# EAGLE schematic HWTestRig (EAGLE 7.4.0)
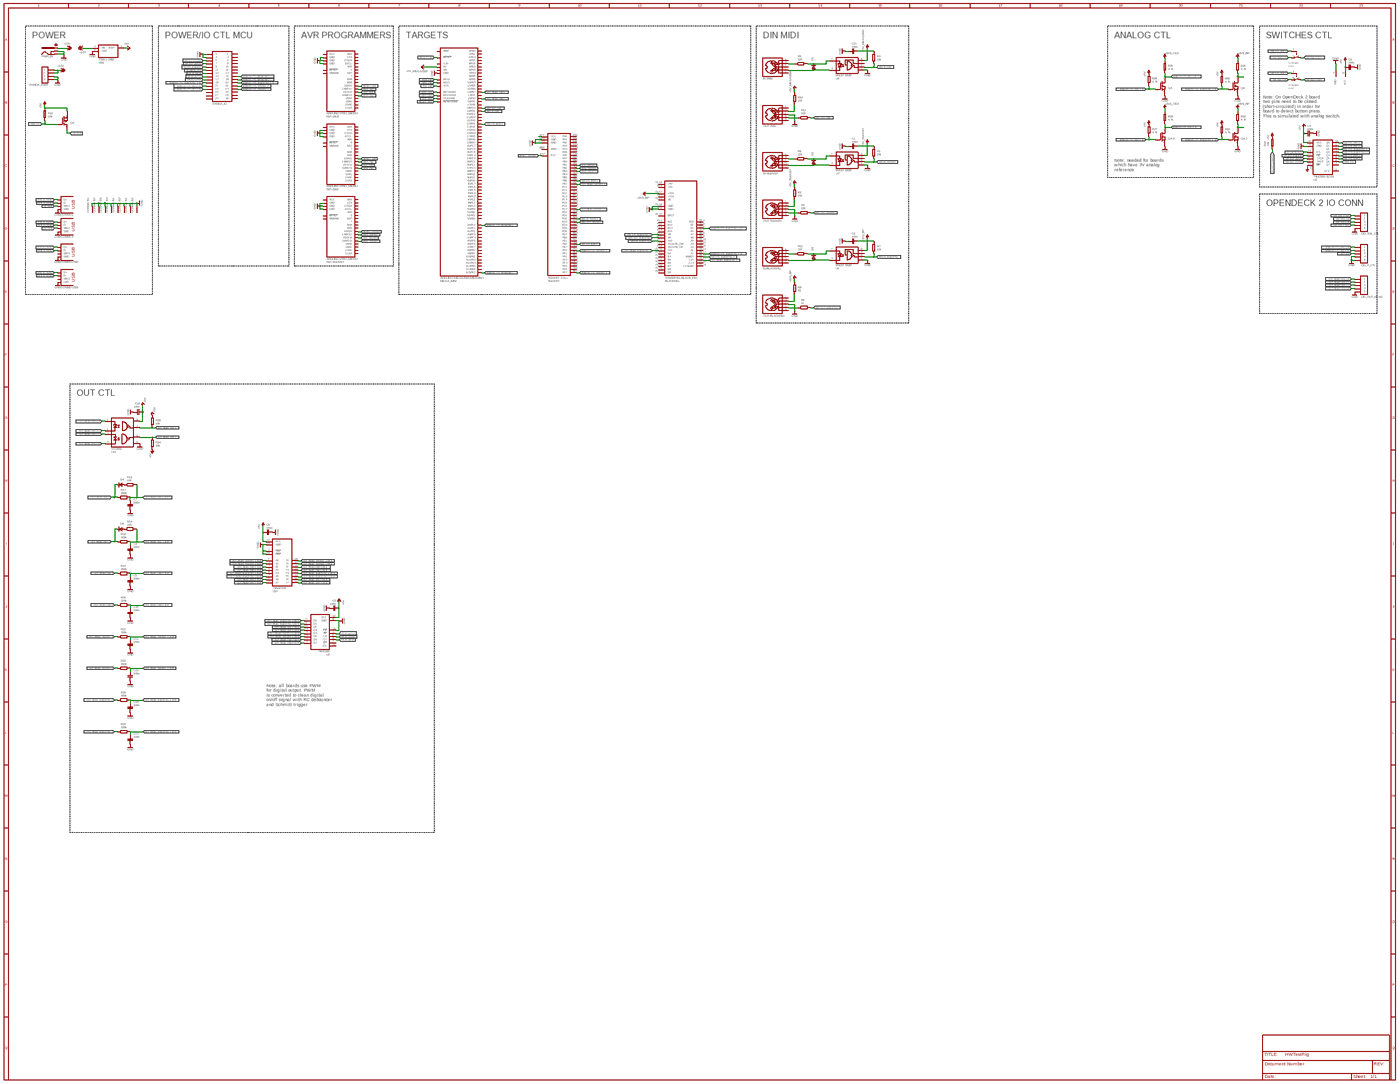
[diagram p0: schematic, sheet 1, overview]
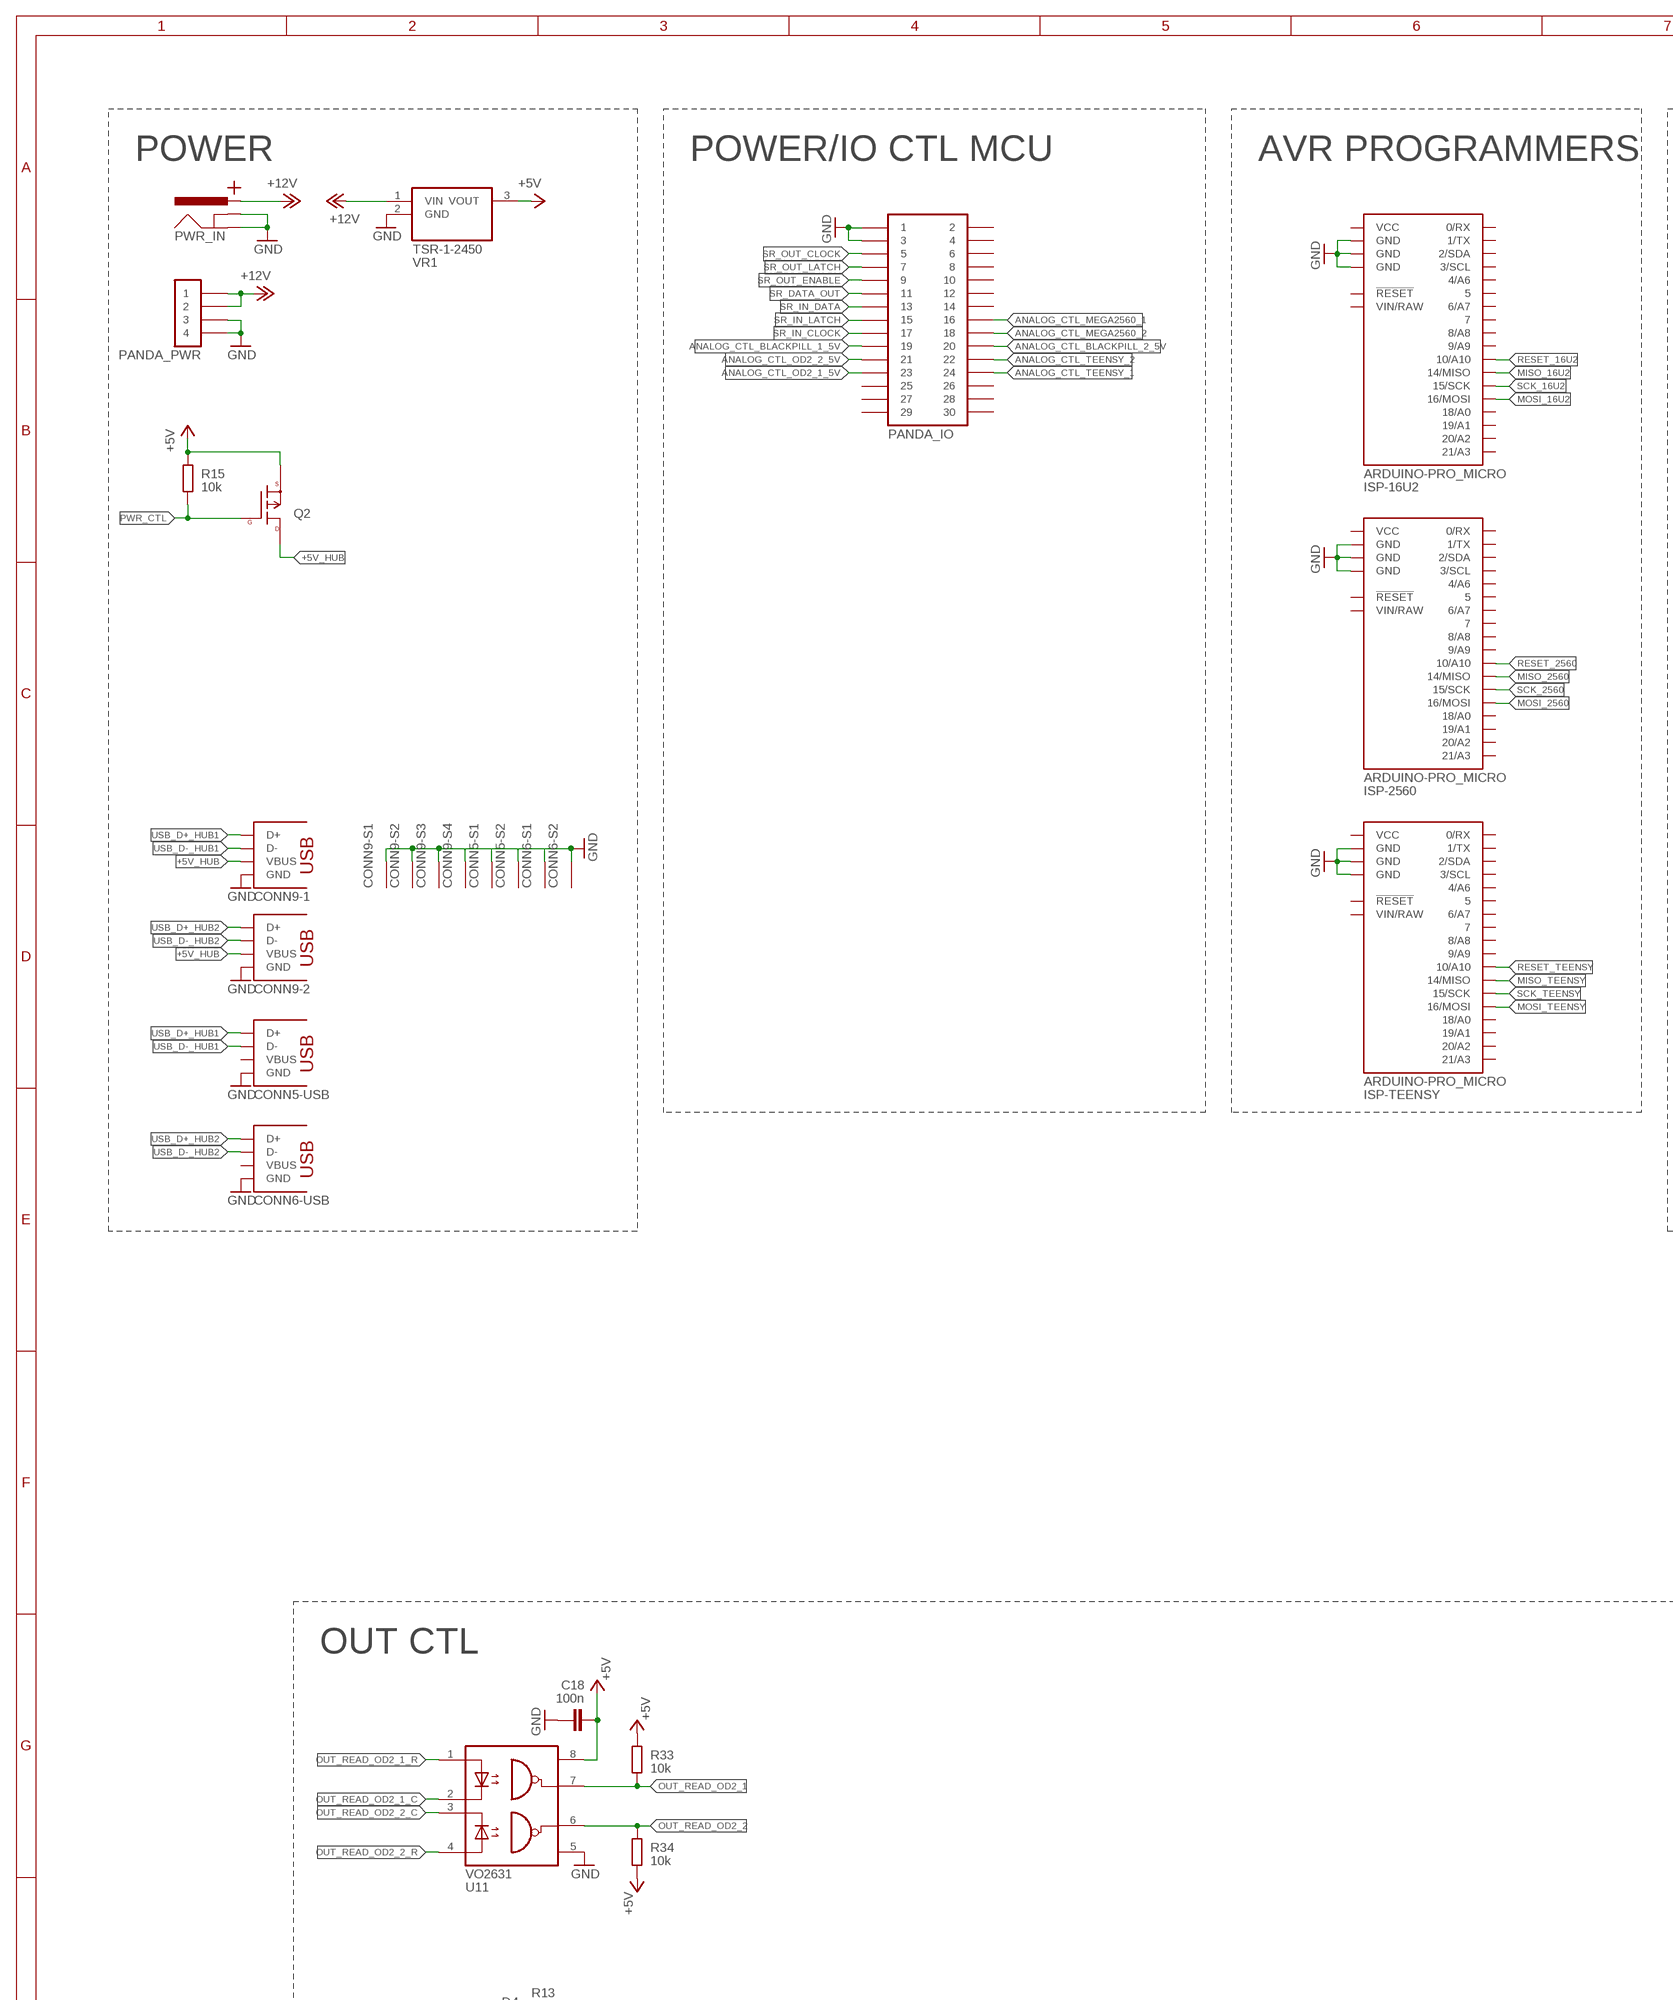
[diagram p1: schematic, sheet 1, part 1 of 6]
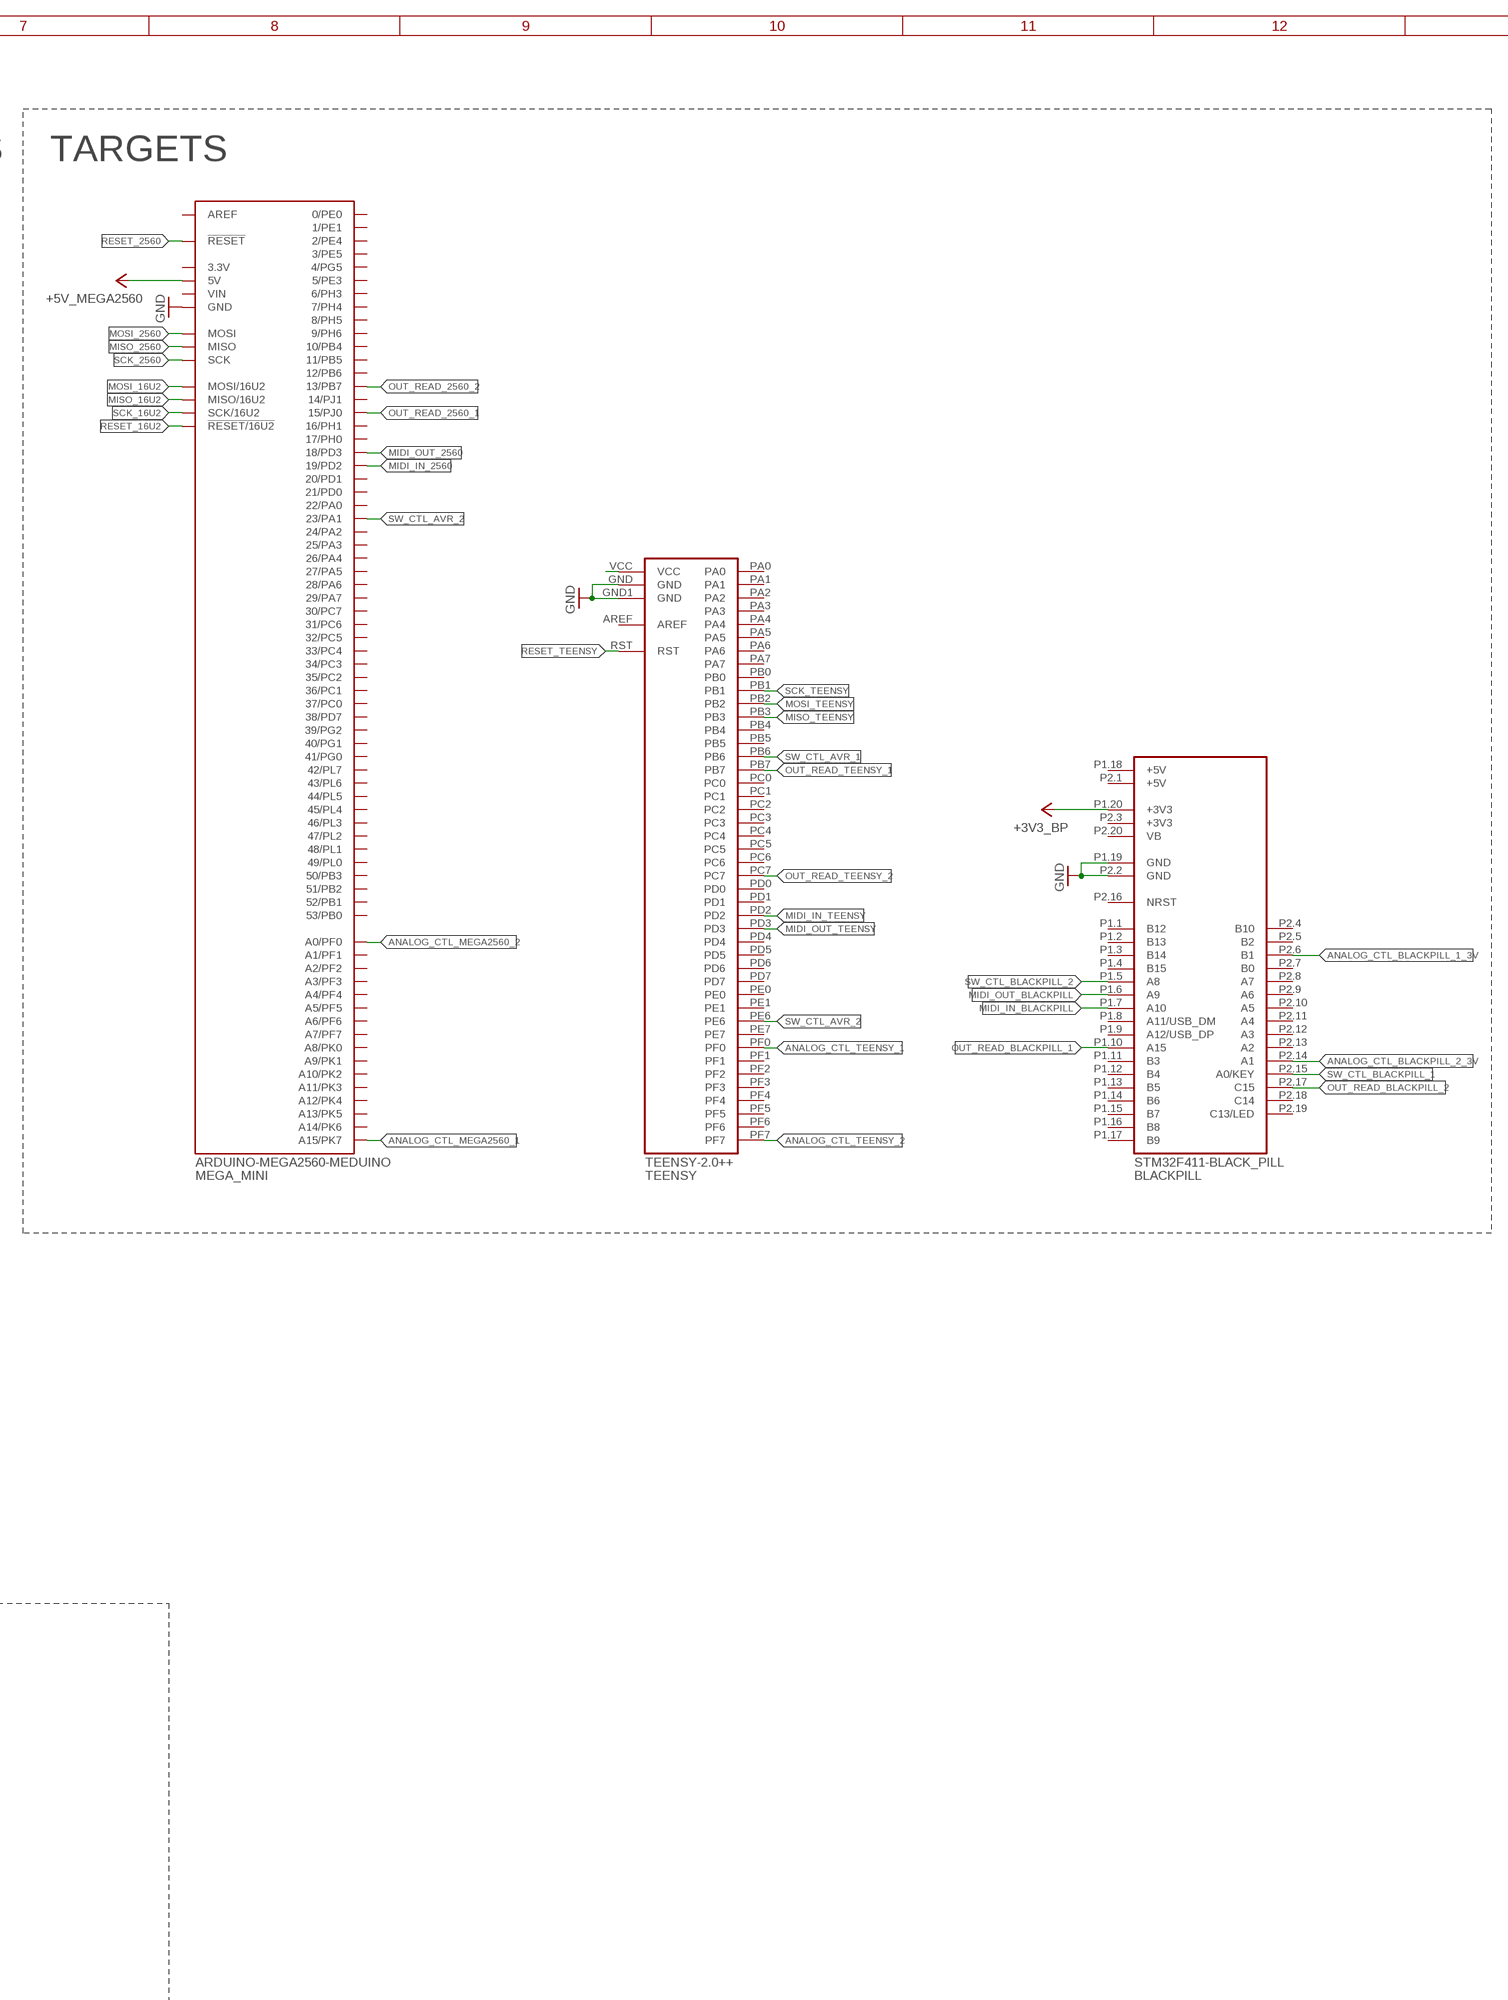
[diagram p2: schematic, sheet 1, part 2 of 6]
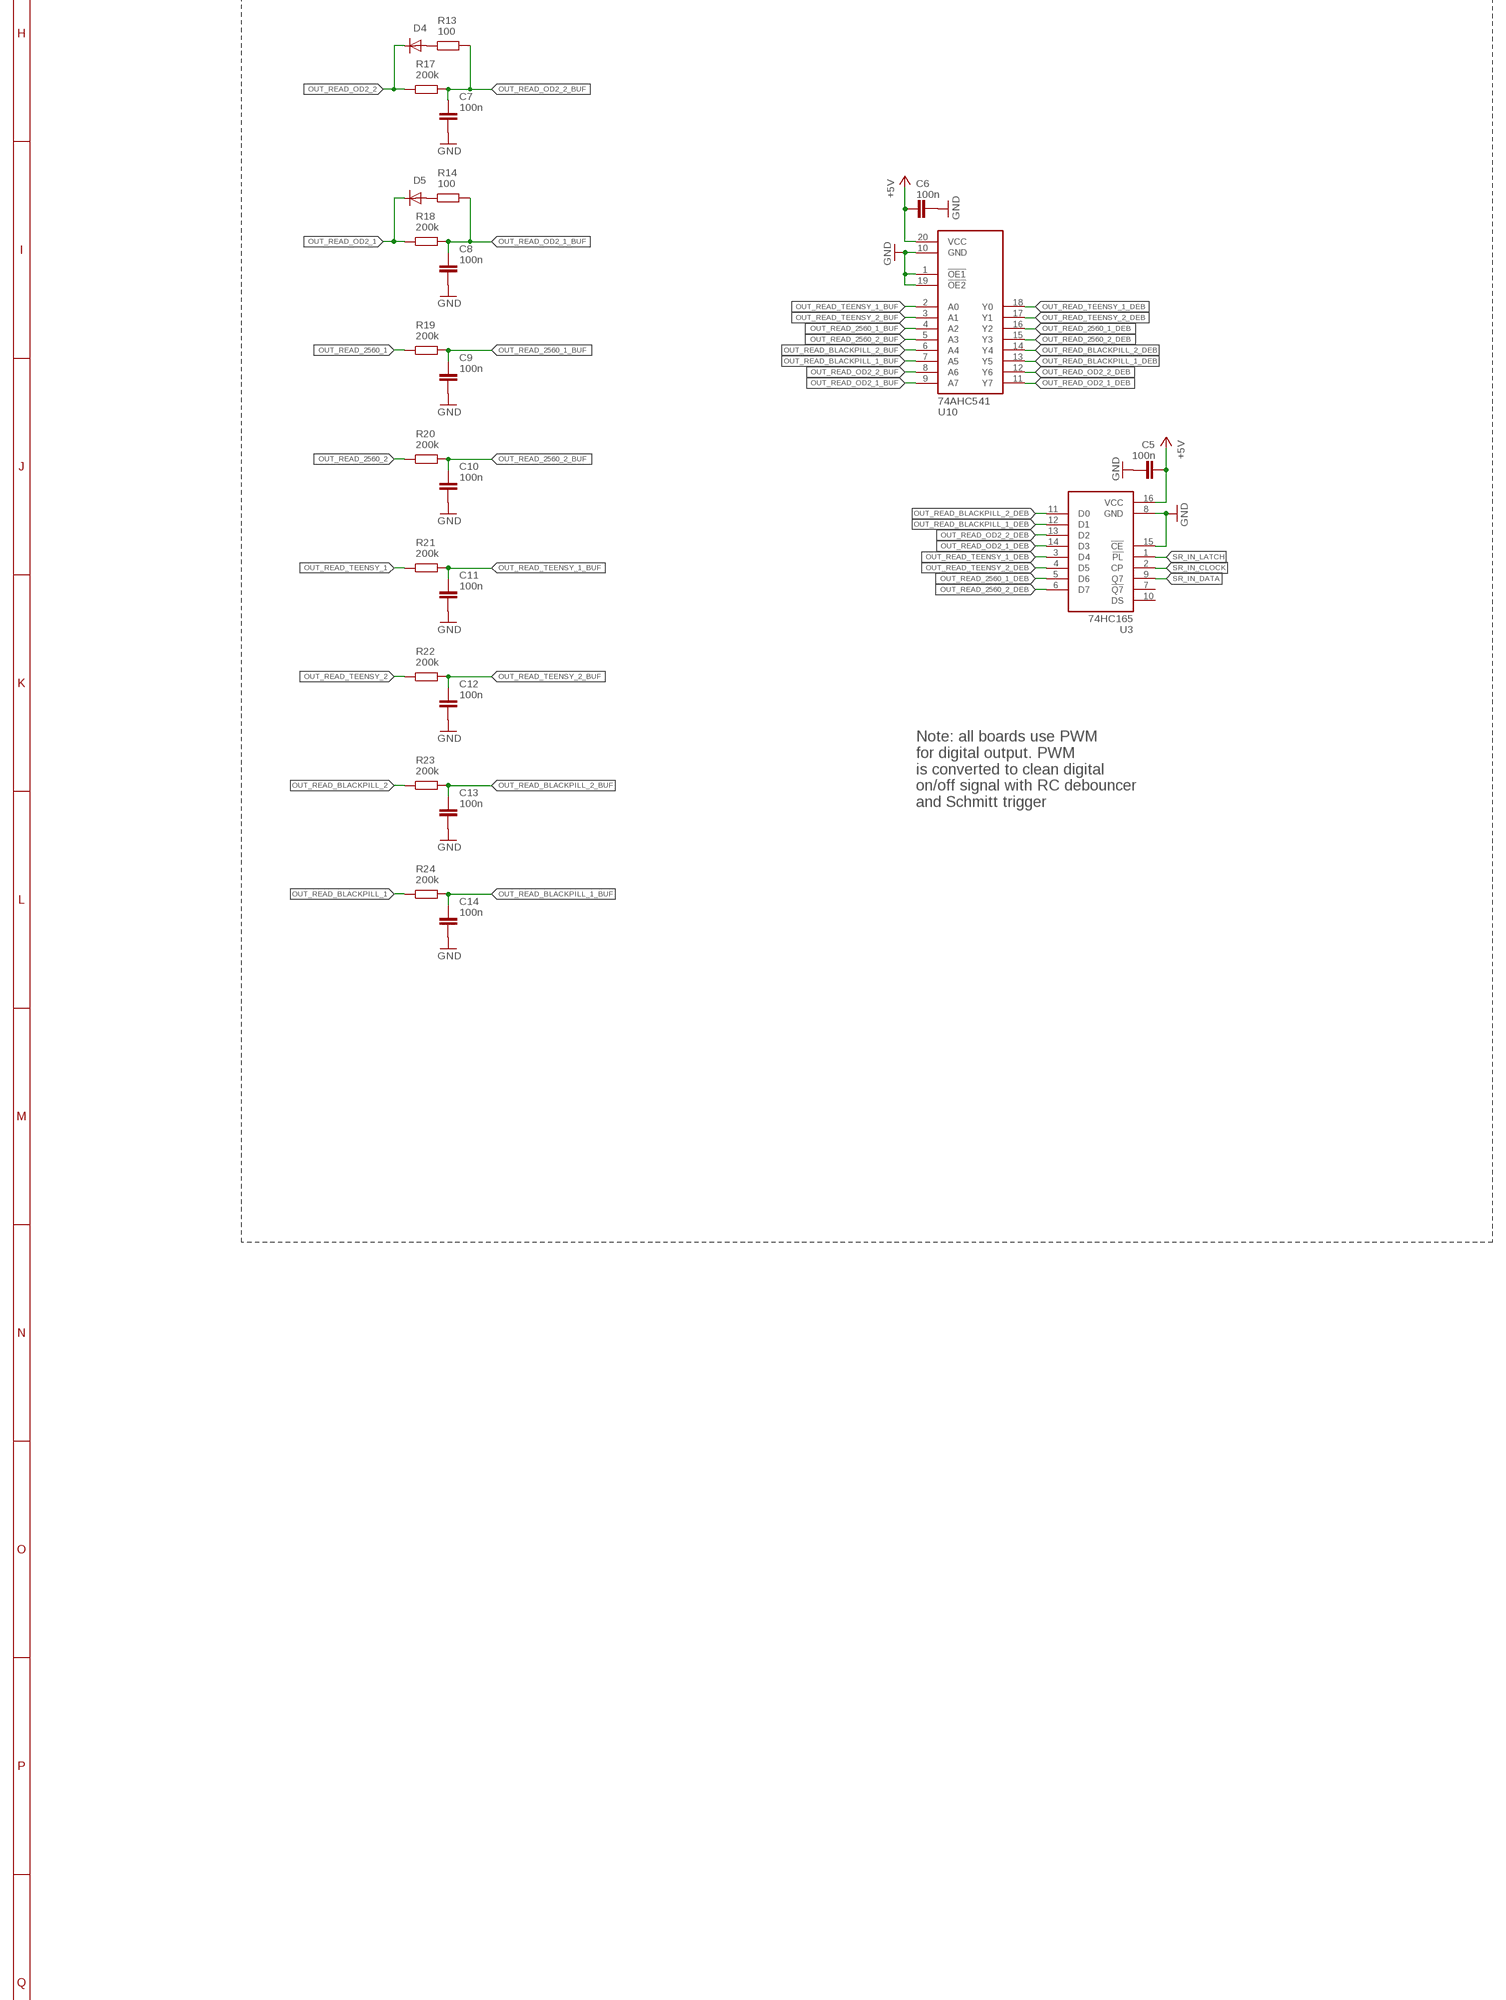
[diagram p3: schematic, sheet 1, part 3 of 6]
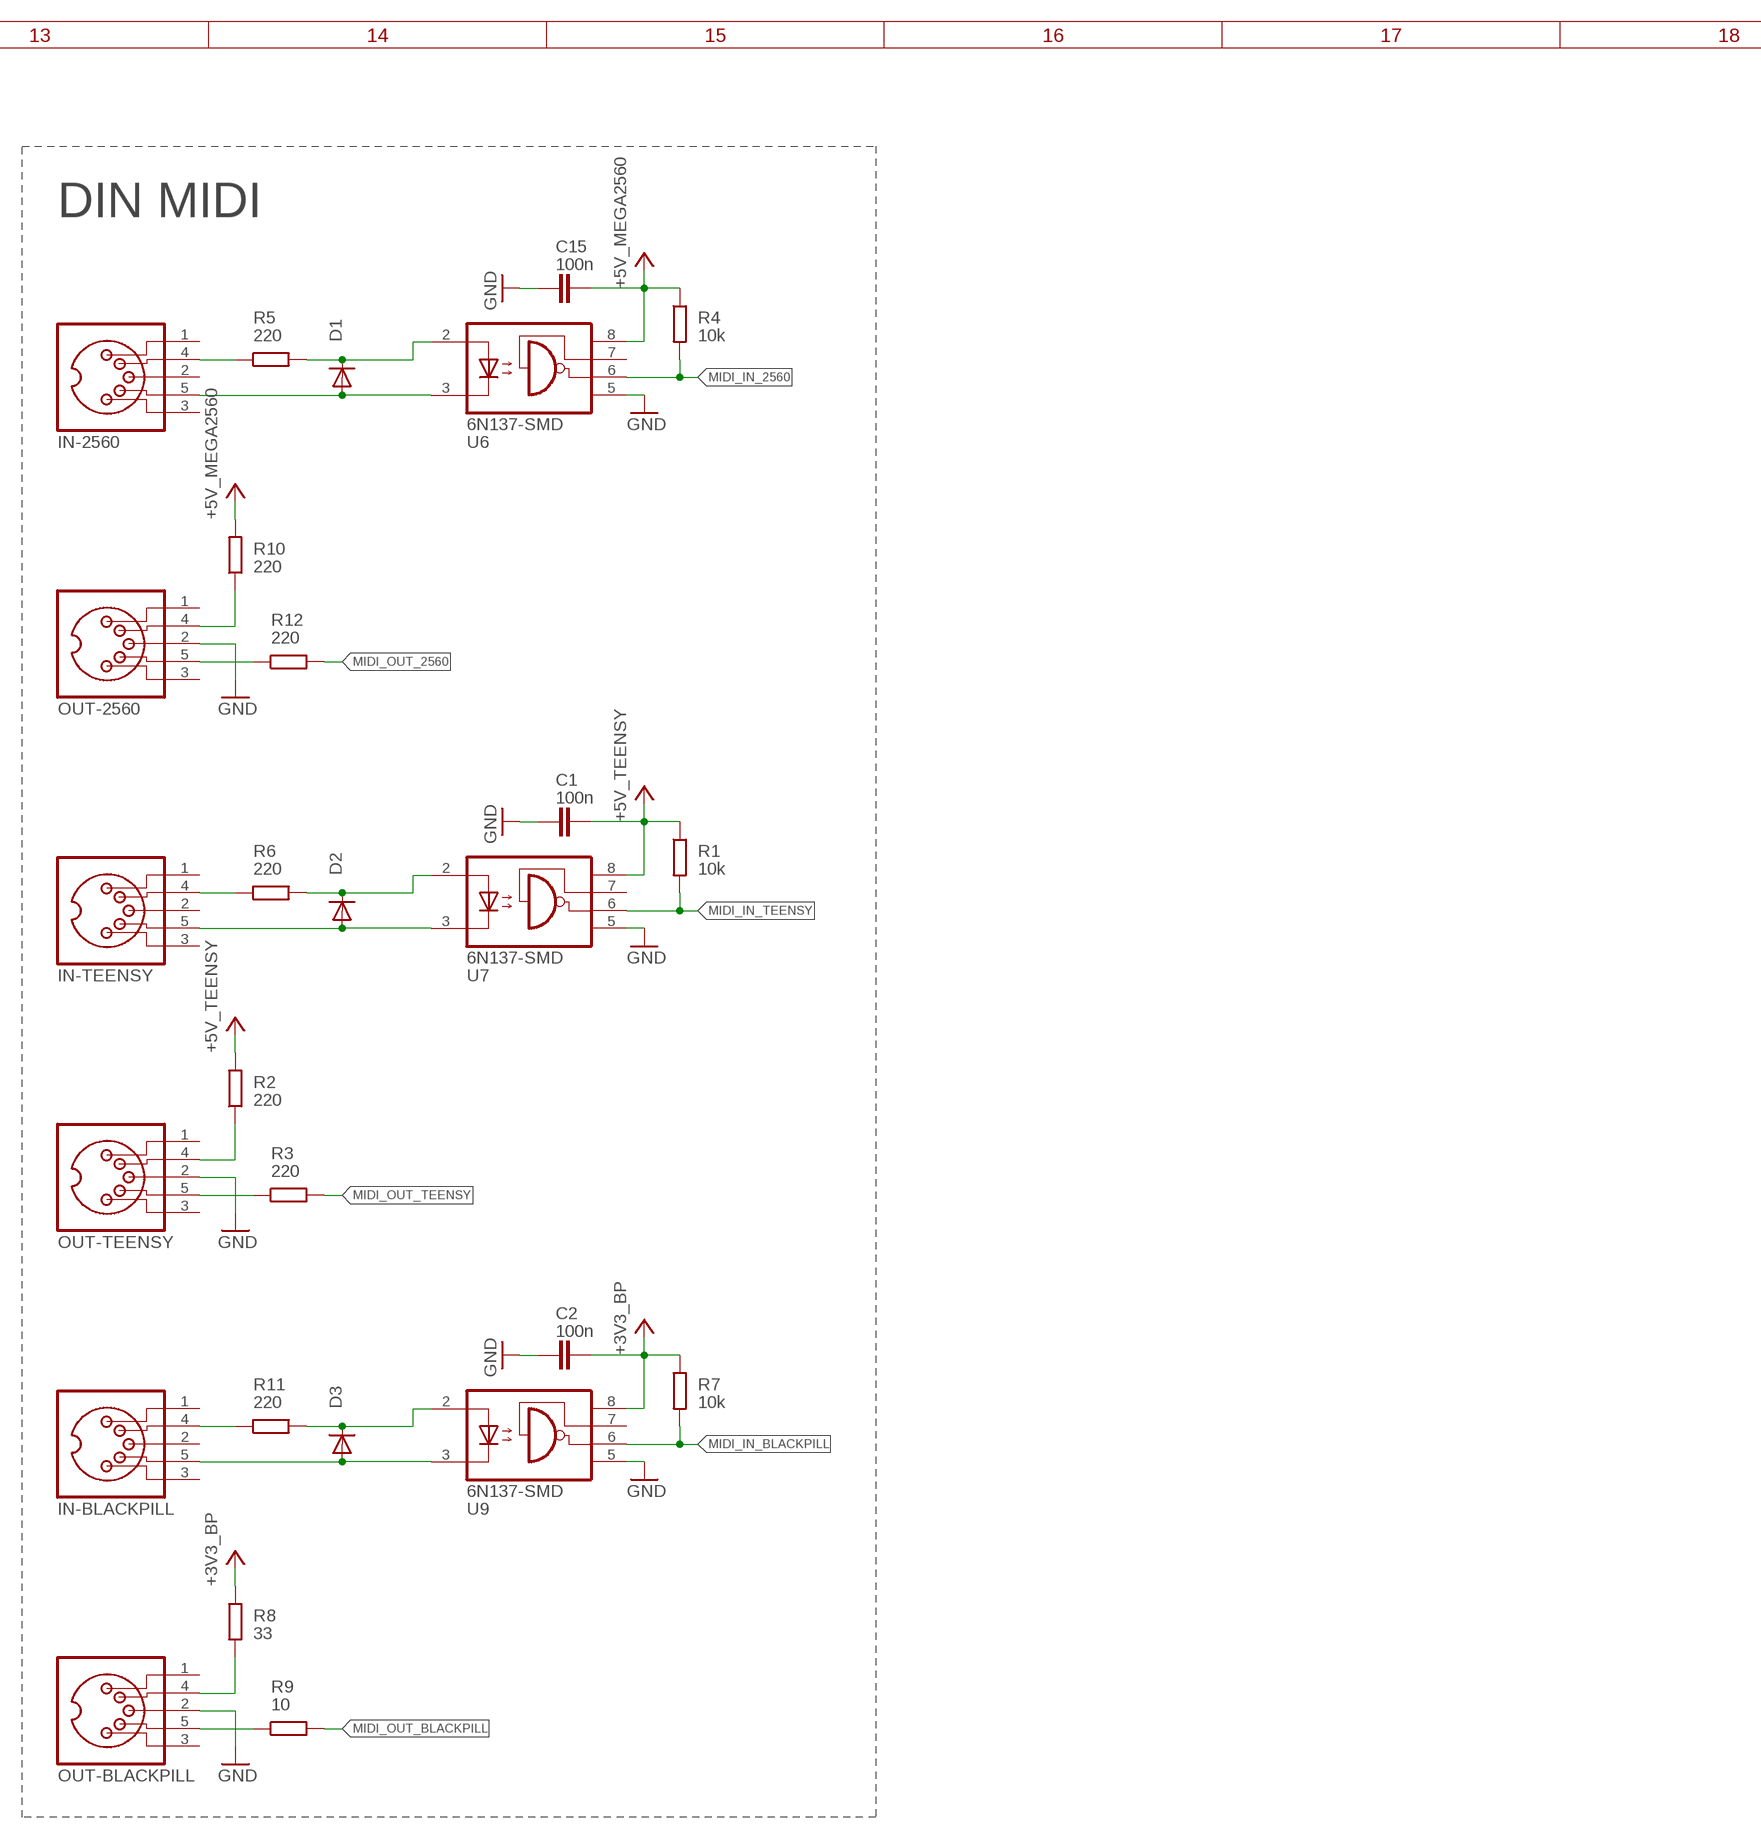
[diagram p4: schematic, sheet 1, part 4 of 6]
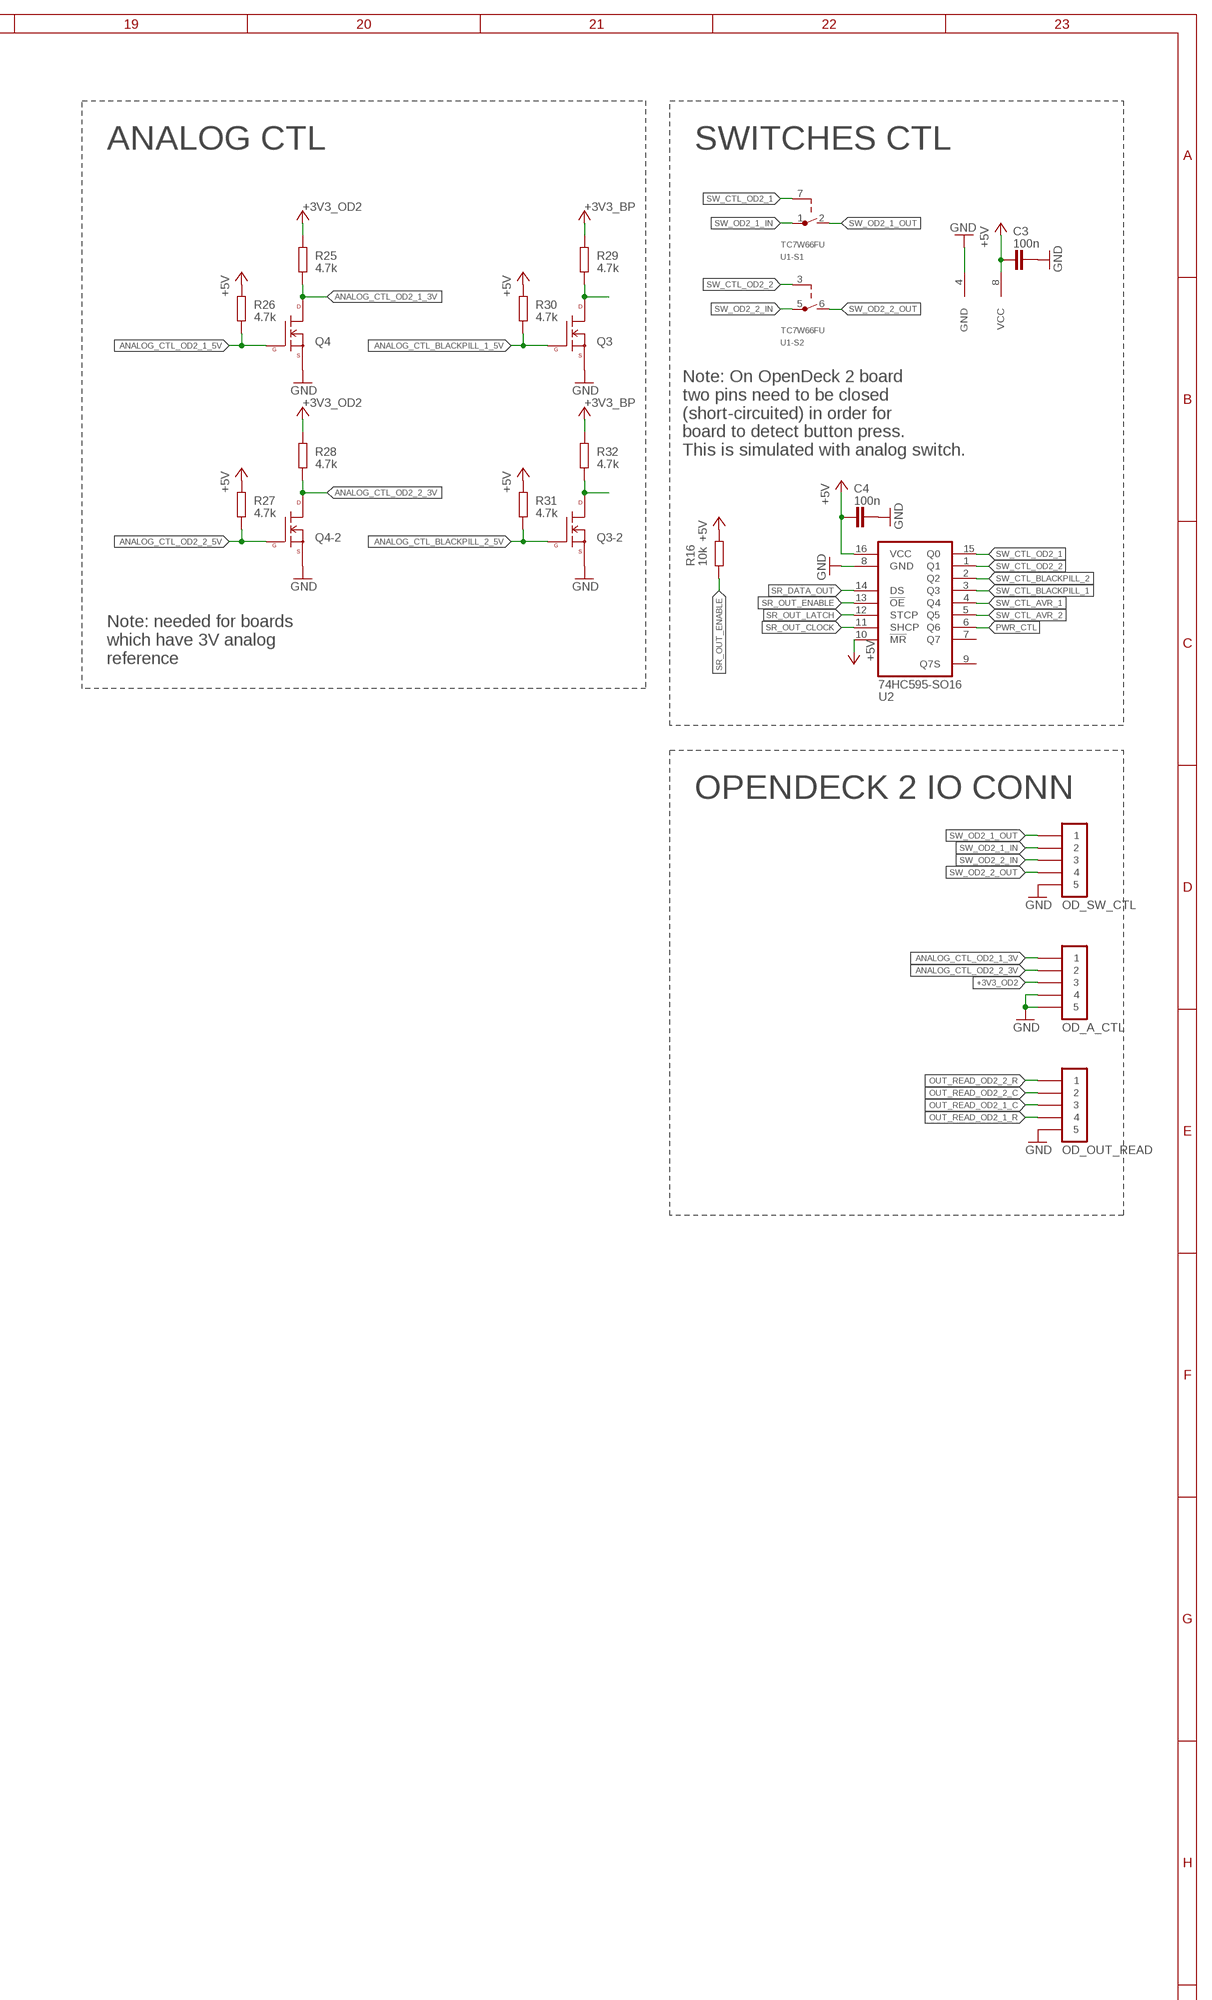
[diagram p5: schematic, sheet 1, part 5 of 6]
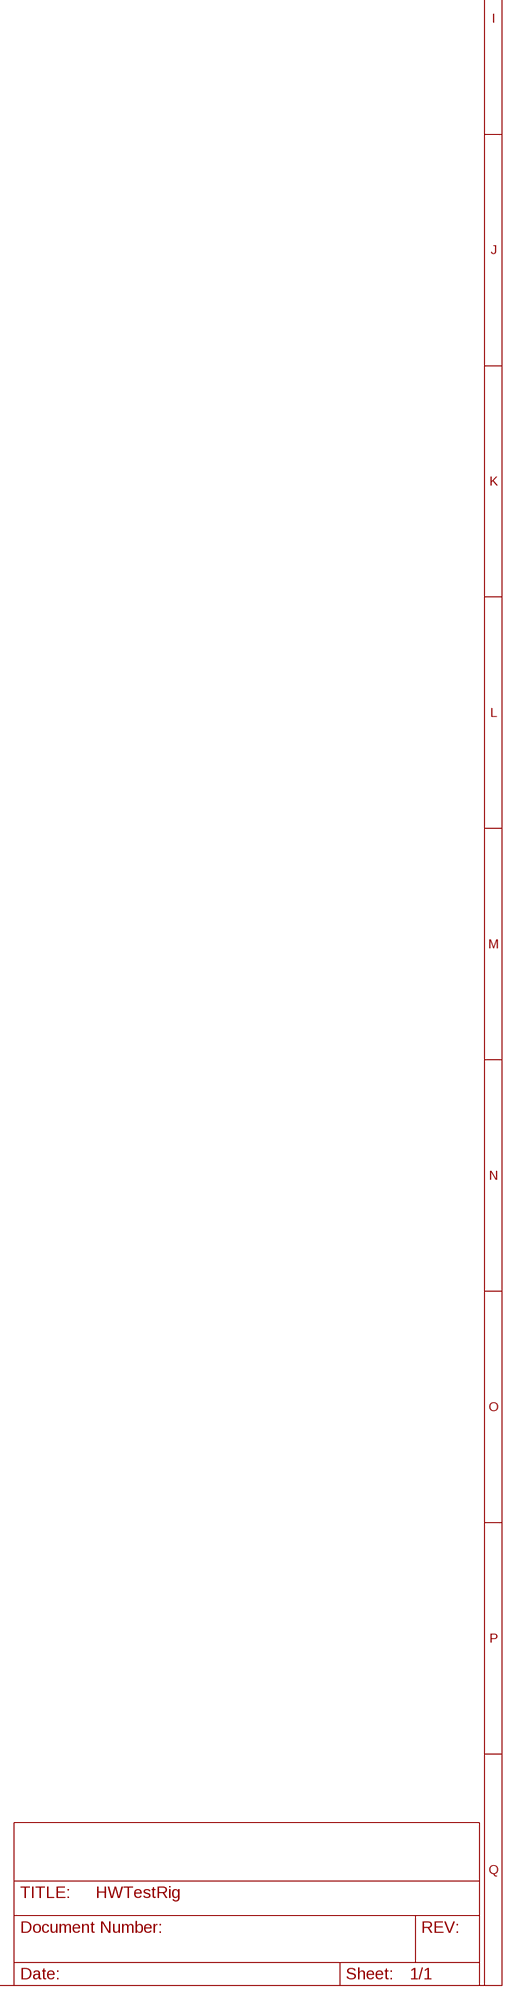
[diagram p6: schematic, sheet 1, part 6 of 6]

## Parts
BLACKPILL  STM32F411-BLACK_PILL  [STM32F411-BLACK_PILL]
C1  100n  CAPACITOR-0805  [C0805]
C2  100n  CAPACITOR-0805  [C0805]
C3  100n  CAPACITOR-0805  [C0805]
C4  100n  CAPACITOR-0805  [C0805]
C5  100n  CAPACITOR-0805  [C0805]
C6  100n  CAPACITOR-0805  [C0805]
C7  100n  CAPACITOR-0805  [C0805]
C8  100n  CAPACITOR-0805  [C0805]
C9  100n  CAPACITOR-0805  [C0805]
C10  100n  CAPACITOR-0805  [C0805]
C11  100n  CAPACITOR-0805  [C0805]
C12  100n  CAPACITOR-0805  [C0805]
C13  100n  CAPACITOR-0805  [C0805]
C14  100n  CAPACITOR-0805  [C0805]
C15  100n  CAPACITOR-0805  [C0805]
C18  100n  CAPACITOR-0805  [C0805]
CONN5  USB-B-H  [USB-B-PTH]
CONN6  USB-B-H  [USB-B-PTH]
CONN9  USB-DUAL  [SS-52100-003]
D1  DIODE-SOD323  [SOD-323]
D2  DIODE-SOD323  [SOD-323]
D3  DIODE-SOD323  [SOD-323]
D4  DIODE-SOD323  [SOD-323]
D5  DIODE-SOD323  [SOD-323]
IN-2560  MIDI_CONN-STD  [DIN5]
IN-BLACKPILL  MIDI_CONN-STD  [DIN5]
IN-TEENSY  MIDI_CONN-STD  [DIN5]
ISP-16U2  ARDUINO-PRO_MICRO  [ARDUINO-PRO_MICRO]
ISP-2560  ARDUINO-PRO_MICRO  [ARDUINO-PRO_MICRO]
ISP-TEENSY  ARDUINO-PRO_MICRO  [ARDUINO-PRO_MICRO]
MEGA_MINI  ARDUINO-MEGA2560-MEDUINO  [ARDUINO-MEGA2560-MEDUINO]
OD_A_CTL  PINHD-1X05-JST-XH-H  [JST-XH-05P-H]
OD_OUT_READ  PINHD-1X05-JST-XH-H  [JST-XH-05P-H]
OD_SW_CTL  PINHD-1X05-JST-XH-H  [JST-XH-05P-H]
OUT-2560  MIDI_CONN-STD  [DIN5]
OUT-BLACKPILL  MIDI_CONN-STD  [DIN5]
OUT-TEENSY  MIDI_CONN-STD  [DIN5]
PANDA_IO  PINHD-2X15  [2X15-2.54]
PANDA_PWR  PINHD-1X04-SMW-TH-2MM-V  [SMW200-04P]
PWR_IN  BARREL_JACK  [BARREL_JACK]
Q2  BSS314PEH6327XTSA1  [SOT23]
Q3  BSS138PS  [SOT-363]
Q4  BSS138PS  [SOT-363]
R1  10k  RESISTOR-0805  [R0805]
R2  220  RESISTOR-0805  [R0805]
R3  220  RESISTOR-0805  [R0805]
R4  10k  RESISTOR-0805  [R0805]
R5  220  RESISTOR-0805  [R0805]
R6  220  RESISTOR-0805  [R0805]
R7  10k  RESISTOR-0805  [R0805]
R8  33  RESISTOR-0805  [R0805]
R9  10  RESISTOR-0805  [R0805]
R10  220  RESISTOR-0805  [R0805]
R11  220  RESISTOR-0805  [R0805]
R12  220  RESISTOR-0805  [R0805]
R13  100  RESISTOR-0805  [R0805]
R14  100  RESISTOR-0805  [R0805]
R15  10k  RESISTOR-0805  [R0805]
R16  10k  RESISTOR-0805  [R0805]
R17  200k  RESISTOR-0805  [R0805]
R18  200k  RESISTOR-0805  [R0805]
R19  200k  RESISTOR-0805  [R0805]
R20  200k  RESISTOR-0805  [R0805]
R21  200k  RESISTOR-0805  [R0805]
R22  200k  RESISTOR-0805  [R0805]
R23  200k  RESISTOR-0805  [R0805]
R24  200k  RESISTOR-0805  [R0805]
R25  4.7k  RESISTOR-0805  [R0805]
R26  4.7k  RESISTOR-0805  [R0805]
R27  4.7k  RESISTOR-0805  [R0805]
R28  4.7k  RESISTOR-0805  [R0805]
R29  4.7k  RESISTOR-0805  [R0805]
R30  4.7k  RESISTOR-0805  [R0805]
R31  4.7k  RESISTOR-0805  [R0805]
R32  4.7k  RESISTOR-0805  [R0805]
R33  10k  RESISTOR-0805  [R0805]
R34  10k  RESISTOR-0805  [R0805]
TEENSY  TEENSY-2.0++  [TEENSY-2.0++]
U1  TC7W66FU  [SM8]
U2  74HC595-SO16  [SO16]
U3  74HC165  [SO16]
U6  6N137-SMD  [SMD-8]
U7  6N137-SMD  [SMD-8]
U9  6N137-SMD  [SMD-8]
U10  74AHC541  [TSSOP20]
U11  VO2631  [DIL08]
VR1  TSR-1-2450  [TSR-1-2450]

## Nets
+3V3_BP: BLACKPILL.P1.20(+3V3) C2.2 R7.1 R8.2 R29.2 R32.2 U9.8(VCC)
+3V3_OD2: OD_A_CTL.3 R25.2 R28.2
+5V [vcc]: C3.1 C4.1 C5.1 C6.1 C18.1 Q2.2(S) R15.2 R16.2 R26.2 R27.2 R30.2 R31.2 R33.2 R34.1 U1.8(VCC) U2.10(!MR) U2.16(VCC) U3.16(VCC) U10.20(VCC) U11.8(VCC) VR1.3(VOUT)
+5V_HUB: CONN9.VBUS1(-1:VBUS) CONN9.VBUS2(-2:VBUS) Q2.3(D)
+5V_MEGA2560 [vcc]: C15.2 MEGA_MINI.+5V1(5V) MEGA_MINI.+5V2(5V) MEGA_MINI.+5V3(5V) MEGA_MINI.+5V(5V) R4.1 R10.2 U6.8(VCC)
+5V_TEENSY [vcc]: C1.2 R1.1 R2.2 TEENSY.VCC U7.8(VCC)
+12V: PANDA_PWR.1 PANDA_PWR.2 PWR_IN.PWR1(PWR) VR1.1(VIN)
ANALOG_CTL_BLACKPILL_1_3V: BLACKPILL.P2.6(B1) Q3.6(D) R29.1
ANALOG_CTL_BLACKPILL_1_5V: PANDA_IO.19 Q3.2(G) R30.1
ANALOG_CTL_BLACKPILL_2_3V: BLACKPILL.P2.14(A1) Q3.3(D) R32.1
ANALOG_CTL_BLACKPILL_2_5V: PANDA_IO.20 Q3.5(G) R31.1
ANALOG_CTL_MEGA2560_1: MEGA_MINI.A15(A15/PK7) PANDA_IO.16
ANALOG_CTL_MEGA2560_2: MEGA_MINI.A0(A0/PF0) PANDA_IO.18
ANALOG_CTL_OD2_1_3V: OD_A_CTL.1 Q4.6(D) R25.1
ANALOG_CTL_OD2_1_5V: PANDA_IO.23 Q4.2(G) R26.1
ANALOG_CTL_OD2_2_3V: OD_A_CTL.2 Q4.3(D) R28.1
ANALOG_CTL_OD2_2_5V: PANDA_IO.21 Q4.5(G) R27.1
ANALOG_CTL_TEENSY_1: PANDA_IO.24 TEENSY.PF0
ANALOG_CTL_TEENSY_2: PANDA_IO.22 TEENSY.PF7
GND: BLACKPILL.P1.19(GND) BLACKPILL.P2.2(GND) C1.1 C2.1 C3.2 C4.2 C5.2 C6.2 C7.1 C8.1 C9.1 C10.1 C11.1 C12.1 C13.1 C14.1 C15.1 C18.2 CONN5.GND(-USB:GND) CONN5.S1(-S1:S) CONN5.S2(-S2:S) CONN6.GND(-USB:GND) CONN6.S1(-S1:S) CONN6.S2(-S2:S) CONN9.GND1(-1:GND) CONN9.GND2(-2:GND) CONN9.S1(-S1:S) CONN9.S2(-S2:S) CONN9.S3(-S3:S) CONN9.S4(-S4:S) ISP-16U2.3(GND) ISP-16U2.4(GND) ISP-16U2.23(GND) ISP-2560.3(GND) ISP-2560.4(GND) ISP-2560.23(GND) ISP-TEENSY.3(GND) ISP-TEENSY.4(GND) ISP-TEENSY.23(GND) MEGA_MINI.GND MEGA_MINI.GND1(GND) MEGA_MINI.GND2(GND) MEGA_MINI.GND3(GND) MEGA_MINI.GND4(GND) MEGA_MINI.GND5(GND) OD_A_CTL.4 OD_A_CTL.5 OD_OUT_READ.5 OD_SW_CTL.5 OUT-2560.2 OUT-BLACKPILL.2 OUT-TEENSY.2 PANDA_IO.1 PANDA_IO.3 PANDA_PWR.3 PANDA_PWR.4 PWR_IN.GND@1(GND) PWR_IN.GND@2(GNDBREAK) Q3.1(S) Q3.4(S) Q4.1(S) Q4.4(S) TEENSY.GND TEENSY.GND1(GND) U1.4(GND) U2.8(GND) U3.8(GND) U3.15(!CE) U6.5(GND) U7.5(GND) U9.5(GND) U10.1(!OE1) U10.10(GND) U10.19(!OE2) U11.5(GND) VR1.2(GND)
MIDI_IN_1: D2.A IN-TEENSY.5 U7.3(C)
MIDI_IN_2: IN-TEENSY.4 R6.1
MIDI_IN_3: D3.A IN-BLACKPILL.5 U9.3(C)
MIDI_IN_4: IN-2560.4 R5.1
MIDI_IN_5: D1.A IN-2560.5 U6.3(C)
MIDI_IN_6: IN-BLACKPILL.4 R11.1
MIDI_IN_2560: MEGA_MINI.19(19/PD2) R4.2 U6.6(VO)
MIDI_IN_BLACKPILL: BLACKPILL.P1.7(A10) R7.2 U9.6(VO)
MIDI_IN_DIODE_OUT: D1.C R5.2 U6.2(A)
MIDI_IN_DIODE_OUT1: D2.C R6.2 U7.2(A)
MIDI_IN_DIODE_OUT2: D3.C R11.2 U9.2(A)
MIDI_IN_TEENSY: R1.2 TEENSY.PD2 U7.6(VO)
MIDI_OUT_1: OUT-TEENSY.4 R2.1
MIDI_OUT_2: OUT-TEENSY.5 R3.1
MIDI_OUT_3: OUT-BLACKPILL.4 R8.1
MIDI_OUT_4: OUT-2560.4 R10.1
MIDI_OUT_5: OUT-2560.5 R12.1
MIDI_OUT_6: OUT-BLACKPILL.5 R9.1
MIDI_OUT_2560: MEGA_MINI.18(18/PD3) R12.2
MIDI_OUT_BLACKPILL: BLACKPILL.P1.6(A9) R9.2
MIDI_OUT_TEENSY: R3.2 TEENSY.PD3
MISO_16U2: ISP-16U2.15(14/MISO) MEGA_MINI.MISO_16U2(MISO/16U2)
MISO_2560: ISP-2560.15(14/MISO) MEGA_MINI.MISO_2560(MISO)
MISO_TEENSY: ISP-TEENSY.15(14/MISO) TEENSY.PB3
MOSI_16U2: ISP-16U2.14(16/MOSI) MEGA_MINI.MOSI_16U2(MOSI/16U2)
MOSI_2560: ISP-2560.14(16/MOSI) MEGA_MINI.MOSI_2560(MOSI)
MOSI_TEENSY: ISP-TEENSY.14(16/MOSI) TEENSY.PB2
N$1: D4.A R13.1
N$2: D5.A R14.1
OUT_READ_2560_1: MEGA_MINI.15(15/PJ0) R19.1
OUT_READ_2560_1_BUF: C9.2 R19.2 U10.4(A2)
OUT_READ_2560_1_DEB: U3.5(D6) U10.16(Y2)
OUT_READ_2560_2: MEGA_MINI.13(13/PB7) R20.1
OUT_READ_2560_2_BUF: C10.2 R20.2 U10.5(A3)
OUT_READ_2560_2_DEB: U3.6(D7) U10.15(Y3)
OUT_READ_BLACKPILL_1: BLACKPILL.P1.10(A15) R24.1
OUT_READ_BLACKPILL_1_BUF: C14.2 R24.2 U10.7(A5)
OUT_READ_BLACKPILL_1_DEB: U3.12(D1) U10.13(Y5)
OUT_READ_BLACKPILL_2: BLACKPILL.P2.17(C15) R23.1
OUT_READ_BLACKPILL_2_BUF: C13.2 R23.2 U10.6(A4)
OUT_READ_BLACKPILL_2_DEB: U3.11(D0) U10.14(Y4)
OUT_READ_OD2_1: D5.C R18.1 R33.1 U11.7(VO1)
OUT_READ_OD2_1_BUF: C8.2 R14.2 R18.2 U10.9(A7)
OUT_READ_OD2_1_C: OD_OUT_READ.3 U11.2(C1)
OUT_READ_OD2_1_DEB: U3.14(D3) U10.11(Y7)
OUT_READ_OD2_1_R: OD_OUT_READ.4 U11.1(A1)
OUT_READ_OD2_2: D4.C R17.1 R34.2 U11.6(VO2)
OUT_READ_OD2_2_BUF: C7.2 R13.2 R17.2 U10.8(A6)
OUT_READ_OD2_2_C: OD_OUT_READ.2 U11.3(C2)
OUT_READ_OD2_2_DEB: U3.13(D2) U10.12(Y6)
OUT_READ_OD2_2_R: OD_OUT_READ.1 U11.4(A2)
OUT_READ_TEENSY_1: R21.1 TEENSY.PB7
OUT_READ_TEENSY_1_BUF: C11.2 R21.2 U10.2(A0)
OUT_READ_TEENSY_1_DEB: U3.3(D4) U10.18(Y0)
OUT_READ_TEENSY_2: R22.1 TEENSY.PC7
OUT_READ_TEENSY_2_BUF: C12.2 R22.2 U10.3(A1)
OUT_READ_TEENSY_2_DEB: U3.4(D5) U10.17(Y1)
PWR_CTL: Q2.1(G) R15.1 U2.6(Q6)
RESET_16U2: ISP-16U2.13(10/A10) MEGA_MINI.RST_16U2(!RESET/16U2)
RESET_2560: ISP-2560.13(10/A10) MEGA_MINI.RESET(!RESET) MEGA_MINI.RESET@1(!RESET)
RESET_TEENSY: ISP-TEENSY.13(10/A10) TEENSY.RST
SCK_16U2: ISP-16U2.16(15/SCK) MEGA_MINI.SCK_16U2(SCK/16U2)
SCK_2560: ISP-2560.16(15/SCK) MEGA_MINI.SCK_2560(SCK)
SCK_TEENSY: ISP-TEENSY.16(15/SCK) TEENSY.PB1
SR_DATA_OUT: PANDA_IO.11 U2.14(DS)
SR_IN_CLOCK: PANDA_IO.17 U3.2(CP)
SR_IN_DATA: PANDA_IO.13 U3.9(Q7)
SR_IN_LATCH: PANDA_IO.15 U3.1(!PL)
SR_OUT_CLOCK: PANDA_IO.5 U2.11(SHCP)
SR_OUT_ENABLE: PANDA_IO.9 R16.1 U2.13(!OE)
SR_OUT_LATCH: PANDA_IO.7 U2.12(STCP)
SW_CTL_AVR_1: TEENSY.PB6 U2.4(Q4)
SW_CTL_AVR_2: MEGA_MINI.23(23/PA1) TEENSY.PE6 U2.5(Q5)
SW_CTL_BLACKPILL_1: BLACKPILL.P2.15(A0/KEY) U2.3(Q3)
SW_CTL_BLACKPILL_2: BLACKPILL.P1.5(A8) U2.2(Q2)
SW_CTL_OD2_1: U1.7(-S1:CTL) U2.15(Q0)
SW_CTL_OD2_2: U1.3(-S2:CTL) U2.1(Q1)
SW_OD2_1_IN: OD_SW_CTL.2 U1.1(-S1:IN/OUT)
SW_OD2_1_OUT: OD_SW_CTL.1 U1.2(-S1:OUT/IN)
SW_OD2_2_IN: OD_SW_CTL.3 U1.5(-S2:IN/OUT)
SW_OD2_2_OUT: OD_SW_CTL.4 U1.6(-S2:OUT/IN)
USB_D+_HUB1: CONN5.D+(-USB:D+) CONN9.D+1(-1:D+)
USB_D+_HUB2: CONN6.D+(-USB:D+) CONN9.D+2(-2:D+)
USB_D-_HUB1: CONN5.D-(-USB:D-) CONN9.D-1(-1:D-)
USB_D-_HUB2: CONN6.D-(-USB:D-) CONN9.D-2(-2:D-)
Unconnected: BLACKPILL.P1.1(B12) BLACKPILL.P1.2(B13) BLACKPILL.P1.3(B14) BLACKPILL.P1.4(B15) BLACKPILL.P1.8(A11/USB_DM) BLACKPILL.P1.9(A12/USB_DP) BLACKPILL.P1.11(B3) BLACKPILL.P1.12(B4) BLACKPILL.P1.13(B5) BLACKPILL.P1.14(B6) BLACKPILL.P1.15(B7) BLACKPILL.P1.16(B8) BLACKPILL.P1.17(B9) BLACKPILL.P1.18(+5V) BLACKPILL.P2.1(+5V) BLACKPILL.P2.3(+3V3) BLACKPILL.P2.4(B10) BLACKPILL.P2.5(B2) BLACKPILL.P2.7(B0) BLACKPILL.P2.8(A7) BLACKPILL.P2.9(A6) BLACKPILL.P2.10(A5) BLACKPILL.P2.11(A4) BLACKPILL.P2.12(A3) BLACKPILL.P2.13(A2) BLACKPILL.P2.16(NRST) BLACKPILL.P2.18(C14) BLACKPILL.P2.19(C13/LED) BLACKPILL.P2.20(VB) CONN5.VBUS(-USB:VBUS) CONN6.VBUS(-USB:VBUS) IN-2560.1 IN-2560.2 IN-2560.3 IN-BLACKPILL.1 IN-BLACKPILL.2 IN-BLACKPILL.3 IN-TEENSY.1 IN-TEENSY.2 IN-TEENSY.3 ISP-16U2.1(1/TX) ISP-16U2.2(0/RX) ISP-16U2.5(2/SDA) ISP-16U2.6(3/SCL) ISP-16U2.7(4/A6) ISP-16U2.8 ISP-16U2.9(6/A7) ISP-16U2.10 ISP-16U2.11(8/A8) ISP-16U2.12(9/A9) ISP-16U2.17(18/A0) ISP-16U2.18(19/A1) ISP-16U2.19(20/A2) ISP-16U2.20(21/A3) ISP-16U2.21(VCC) ISP-16U2.22(!RESET) ISP-16U2.24(VIN/RAW) ISP-2560.1(1/TX) ISP-2560.2(0/RX) ISP-2560.5(2/SDA) ISP-2560.6(3/SCL) ISP-2560.7(4/A6) ISP-2560.8 ISP-2560.9(6/A7) ISP-2560.10 ISP-2560.11(8/A8) ISP-2560.12(9/A9) ISP-2560.17(18/A0) ISP-2560.18(19/A1) ISP-2560.19(20/A2) ISP-2560.20(21/A3) ISP-2560.21(VCC) ISP-2560.22(!RESET) ISP-2560.24(VIN/RAW) ISP-TEENSY.1(1/TX) ISP-TEENSY.2(0/RX) ISP-TEENSY.5(2/SDA) ISP-TEENSY.6(3/SCL) ISP-TEENSY.7(4/A6) ISP-TEENSY.8 ISP-TEENSY.9(6/A7) ISP-TEENSY.10 ISP-TEENSY.11(8/A8) ISP-TEENSY.12(9/A9) ISP-TEENSY.17(18/A0) ISP-TEENSY.18(19/A1) ISP-TEENSY.19(20/A2) ISP-TEENSY.20(21/A3) ISP-TEENSY.21(VCC) ISP-TEENSY.22(!RESET) ISP-TEENSY.24(VIN/RAW) MEGA_MINI.2(2/PE4) MEGA_MINI.3(3/PE5) MEGA_MINI.4(4/PG5) MEGA_MINI.5(5/PE3) MEGA_MINI.6(6/PH3) MEGA_MINI.7(7/PH4) MEGA_MINI.8(8/PH5) MEGA_MINI.9(9/PH6) MEGA_MINI.10(10/PB4) MEGA_MINI.11(11/PB5) MEGA_MINI.12(12/PB6) MEGA_MINI.14(14/PJ1) MEGA_MINI.16(16/PH1) MEGA_MINI.17(17/PH0) MEGA_MINI.20(20/PD1) MEGA_MINI.21(21/PD0) MEGA_MINI.22(22/PA0) MEGA_MINI.24(24/PA2) MEGA_MINI.25(25/PA3) MEGA_MINI.26(26/PA4) MEGA_MINI.27(27/PA5) MEGA_MINI.28(28/PA6) MEGA_MINI.29(29/PA7) MEGA_MINI.30(30/PC7) MEGA_MINI.31(31/PC6) MEGA_MINI.32(32/PC5) MEGA_MINI.33(33/PC4) MEGA_MINI.34(34/PC3) MEGA_MINI.35(35/PC2) MEGA_MINI.36(36/PC1) MEGA_MINI.37(37/PC0) MEGA_MINI.38(38/PD7) MEGA_MINI.39(39/PG2) MEGA_MINI.40(40/PG1) MEGA_MINI.41(41/PG0) MEGA_MINI.42(42/PL7) MEGA_MINI.43(43/PL6) MEGA_MINI.44(44/PL5) MEGA_MINI.45(45/PL4) MEGA_MINI.46(46/PL3) MEGA_MINI.47(47/PL2) MEGA_MINI.48(48/PL1) MEGA_MINI.49(49/PL0) MEGA_MINI.50(50/PB3) MEGA_MINI.51(51/PB2) MEGA_MINI.52(52/PB1) MEGA_MINI.53(53/PB0) MEGA_MINI.+3V3(3.3V) MEGA_MINI.+3V31(3.3V) MEGA_MINI.A1(A1/PF1) MEGA_MINI.A2(A2/PF2) MEGA_MINI.A3(A3/PF3) MEGA_MINI.A4(A4/PF4) MEGA_MINI.A5(A5/PF5) MEGA_MINI.A6(A6/PF6) MEGA_MINI.A7(A7/PF7) MEGA_MINI.A8(A8/PK0) MEGA_MINI.A9(A9/PK1) MEGA_MINI.A10(A10/PK2) MEGA_MINI.A11(A11/PK3) MEGA_MINI.A12(A12/PK4) MEGA_MINI.A13(A13/PK5) MEGA_MINI.A14(A14/PK6) MEGA_MINI.AREF MEGA_MINI.RX0(0/PE0) MEGA_MINI.TX0(1/PE1) MEGA_MINI.VIN MEGA_MINI.VIN1(VIN) OUT-2560.1 OUT-2560.3 OUT-BLACKPILL.1 OUT-BLACKPILL.3 OUT-TEENSY.1 OUT-TEENSY.3 PANDA_IO.2 PANDA_IO.4 PANDA_IO.6 PANDA_IO.8 PANDA_IO.10 PANDA_IO.12 PANDA_IO.14 PANDA_IO.25 PANDA_IO.26 PANDA_IO.27 PANDA_IO.28 PANDA_IO.29 PANDA_IO.30 TEENSY.AREF TEENSY.PA0 TEENSY.PA1 TEENSY.PA2 TEENSY.PA3 TEENSY.PA4 TEENSY.PA5 TEENSY.PA6 TEENSY.PA7 TEENSY.PB0 TEENSY.PB4 TEENSY.PB5 TEENSY.PC0 TEENSY.PC1 TEENSY.PC2 TEENSY.PC3 TEENSY.PC4 TEENSY.PC5 TEENSY.PC6 TEENSY.PD0 TEENSY.PD1 TEENSY.PD4 TEENSY.PD5 TEENSY.PD6 TEENSY.PD7 TEENSY.PE0 TEENSY.PE1 TEENSY.PE7 TEENSY.PF1 TEENSY.PF2 TEENSY.PF3 TEENSY.PF4 TEENSY.PF5 TEENSY.PF6 U2.7(Q7) U2.9(Q7S) U3.7(!Q7) U3.10(DS) U6.7(VE) U7.7(VE) U9.7(VE)

## Notes on the sheet
- POWER | POWER/IO CTL MCU | AVR PROGRAMMERS | TARGETS | DIN MIDI | ANALOG CTL | SWITCHES CTL
- Note: On OpenDeck 2 board
  two pins need to be closed
  (short-circuited) in order for
  board to detect button press.
  This is simulated with analog switch.
- Note: needed for boards
  which have 3V analog
  reference
- OPENDECK 2 IO CONN
- OUT CTL
- Note: all boards use PWM
  for digital output. PWM
  is converted to clean digital
  on/off signal with RC debouncer
  and Schmitt trigger

## Library data of the parts
BLACKPILL = igor_lbr:STM32F411-BLACK_PILL: STM32F411 Black Pill development board
C1-C15 C18 = igor_lbr:CAPACITOR: Capacitor
CONN5 CONN6 = igor_lbr:USB: USB B connector, horizontal
CONN9 = igor_lbr:USB-DUAL: Dual USB 2.0 connector
D1-D5 = igor_lbr:DIODE: Diode; MANUFACTURER: Comchip Technology; MPN: 1N4148WS-HF
IN-2560 IN-BLACKPILL IN-TEENSY OUT-2560 OUT-BLACKPILL OUT-TEENSY = igor_lbr:MIDI_CONN: DIN MIDI connector; MANUFACTURER: Switchcraft; MPN: 57PC5F
ISP-16U2 ISP-2560 ISP-TEENSY = igor_lbr:ARDUINO-PRO_MICRO
MEGA_MINI = igor_lbr:ARDUINO-MEGA2560: Arduino Mega2560
OD_A_CTL OD_OUT_READ OD_SW_CTL = igor_lbr:PINHD-1X05: Pin Header
PANDA_IO = igor_lbr:PINHD-2X15
PANDA_PWR = igor_lbr:PINHD-1X04
PWR_IN = igor_lbr:BARREL_JACK: 5.5mm jack, with a 2.1mm center pole diameter; MANUFACTURER: Gravitech; MPN: CON-SOCJ-2155
Q2 = igor_lbr:BSS314PEH6327XTSA1: P-Channel 20 V (D-S) MOSFET; MANUFACTURER: Infineon Technologies; MPN: BSS314PEH6327XTSA1
Q3 Q4 = igor_lbr:BSS138PS: 60 V, 320 mA dual N-channel Trench MOSFET; MANUFACTURER: Nexperia; MPN: BSS138PS
R1-R34 = igor_lbr:RESISTOR: Resistor
TEENSY = igor_lbr:TEENSY-2.0++: Teensy++ 2.0 with Atmel AT90USB1286
U1 = igor_lbr:TC7W66F*: Dual Bilateral Switch; MANUFACTURER: Toshiba; MPN: TC7W66FU,LF
U2 = igor_lbr:74*595: 8-bit serial-in, parallel-out shift register; MANUFACTURER: Nexperia; MPN: 74HC595D
U3 = igor_lbr:74*165: 8-bit parallel-in/serial out shift register; MANUFACTURER: Nexperia; MPN: 74HC165D
U6 U7 U9 = igor_lbr:6N137: High Speed Optocoupler; MANUFACTURER: Lite-On; MPN: 6N137S
U10 = igor_lbr:74A*541: Octal buffer/line driver; 3-state; MANUFACTURER: Nexperia; MPN: 74AHC541PW,118
U11 = igor_lbr:VO2631: High Speed Optocoupler, Dual Channel; MANUFACTURER: Vishay; MPN: VO2631
VR1 = igor_lbr:TSR-1-2450: DC/DC Step-Down Converter; MANUFACTURER: Traco Power; MPN: TSR 1-2450

## Net classes
1 vcc: width 0.254 mm